# EAGLE schematic QED_2550_dos_caras (EAGLE 6.1)
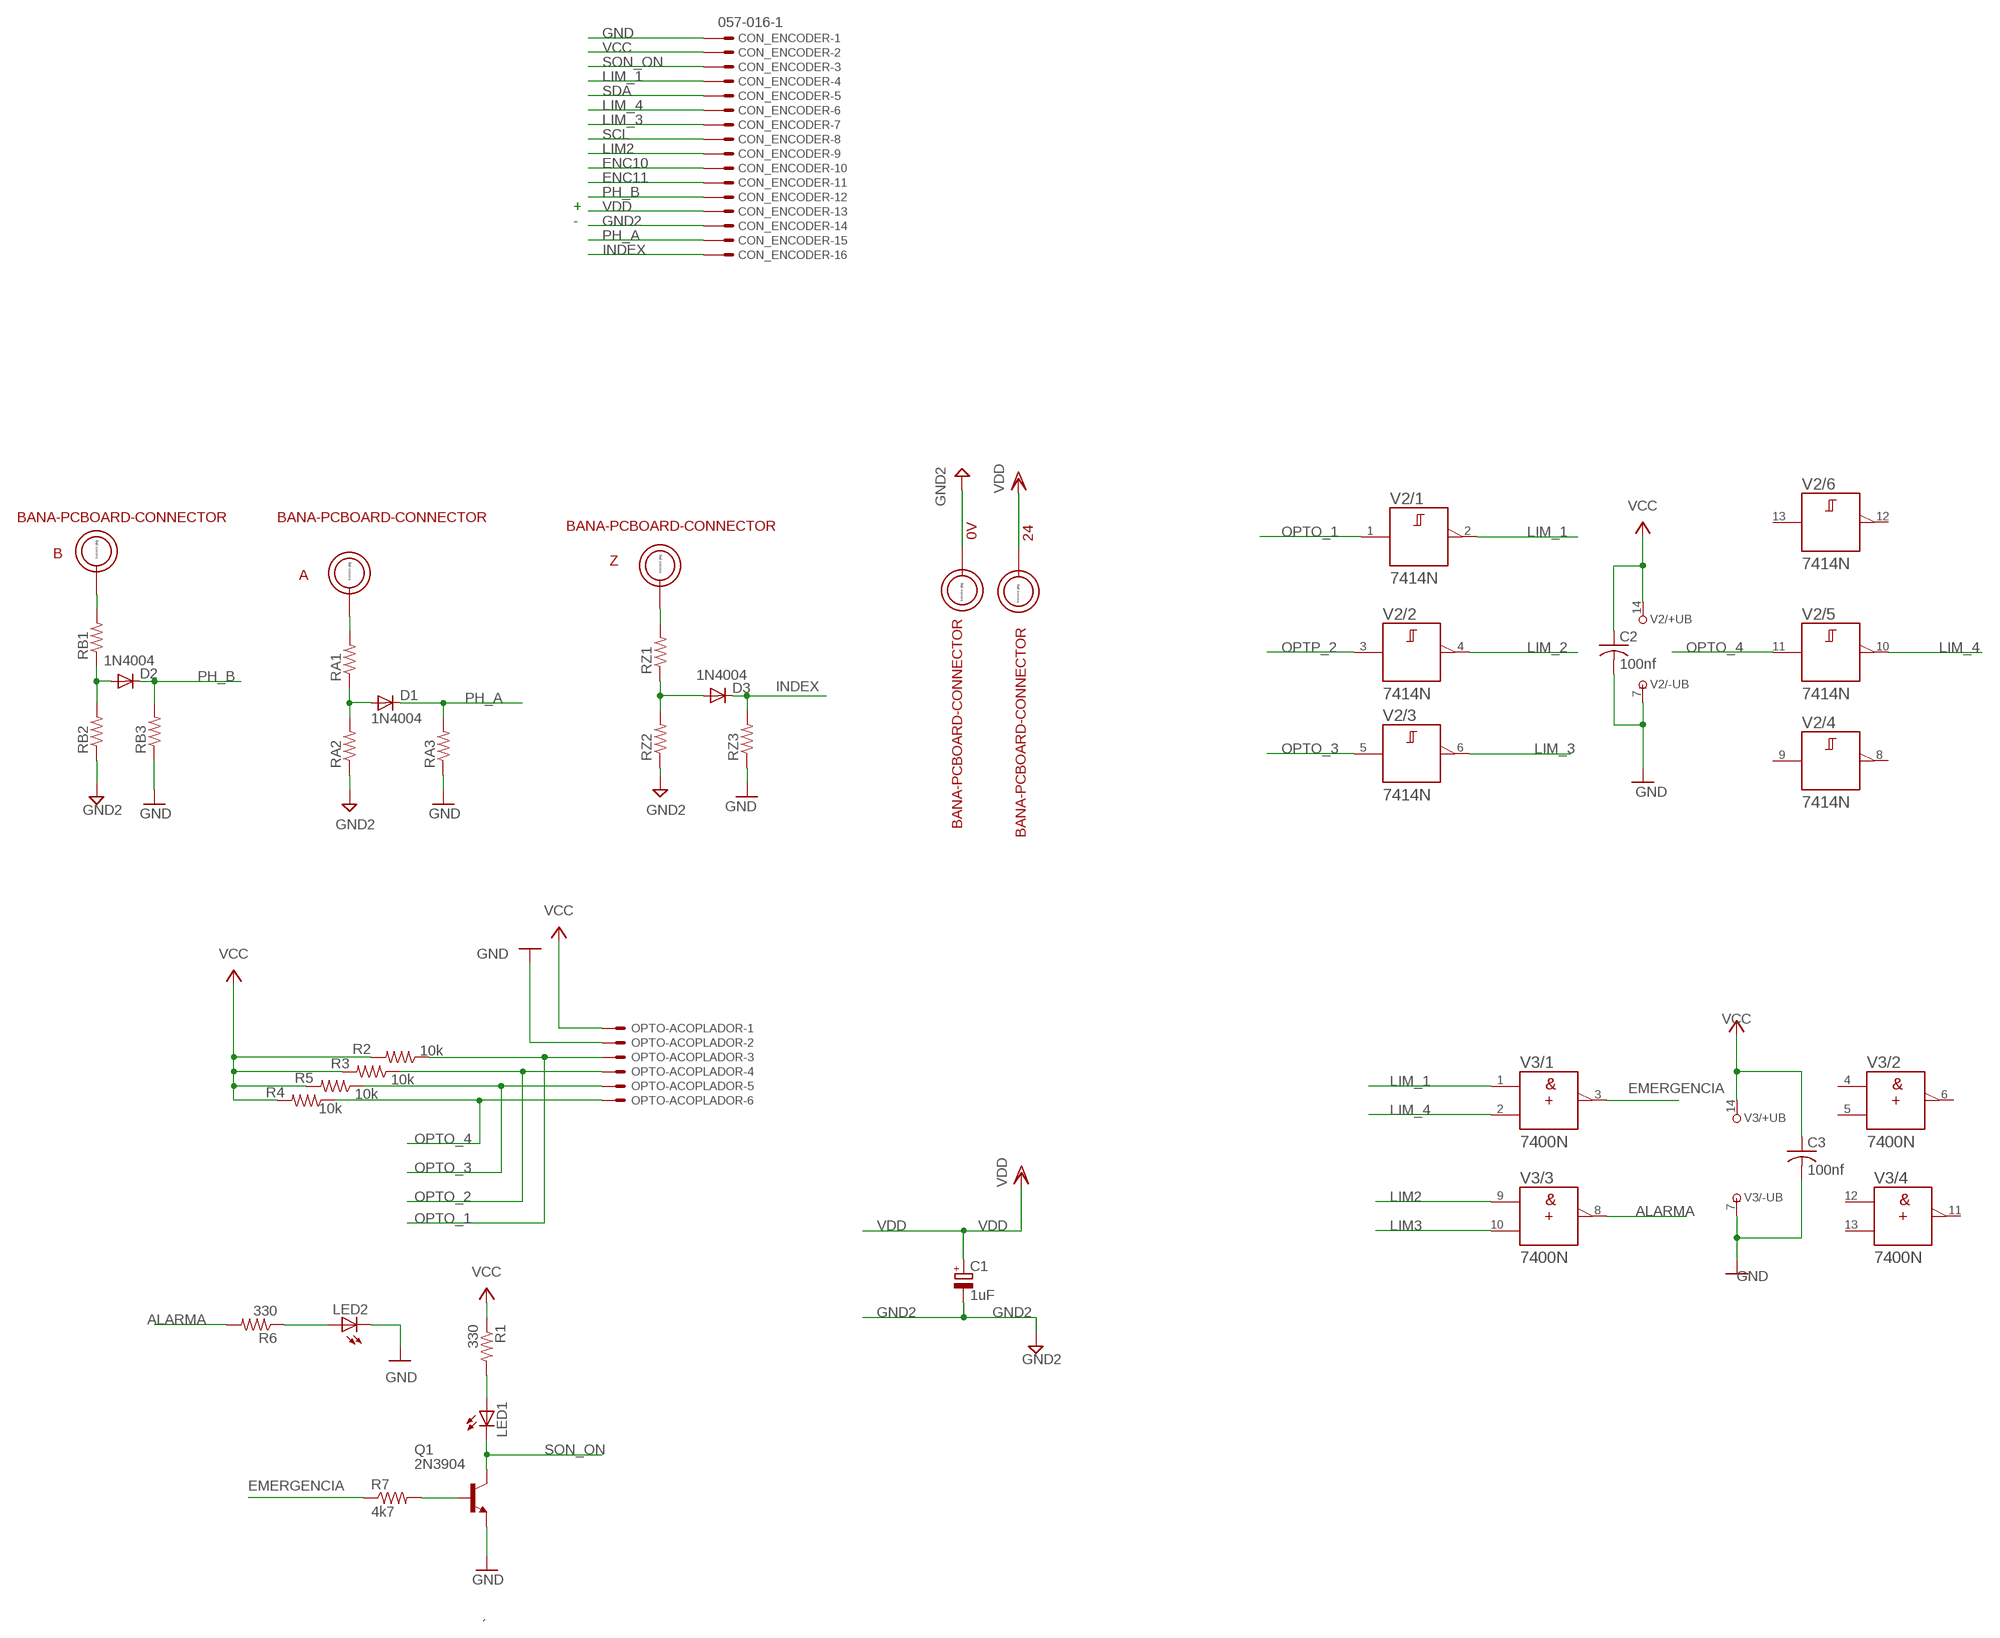
[diagram p0: schematic, sheet 1]

## Parts
0V  BANA-PCBOARD-CONNECTOR  [BANA_PLUG]
24  BANA-PCBOARD-CONNECTOR  [BANA_PLUG]
A  BANA-PCBOARD-CONNECTOR  [BANA_PLUG]
B  BANA-PCBOARD-CONNECTOR  [BANA_PLUG]
C1  1uF  CPOL-EUE2.5-6  [E2,5-6]
C2  100nf  C-US025-024X044  [C025-024X044]
C3  100nf  C-US025-024X044  [C025-024X044]
CON_ENCODER  057-016-1  [057-016-1]
D1  1N4004  [DO41-10]
D2  1N4004  [DO41-10]
D3  1N4004  [DO41-10]
LED1  LED5MM  [LED5MM]
LED2  LED5MM  [LED5MM]
OPTO-ACOPLADOR  22-23-2061  [22-23-2061]
Q1  2N3904  [TO92]
R1  330  R-US_0204/7  [0204/7]
R2  10k  R-US_0204/7  [0204/7]
R3  10k  R-US_0204/7  [0204/7]
R4  10k  R-US_0204/7  [0204/7]
R5  10k  R-US_0204/7  [0204/7]
R6  330  R-US_0204/7  [0204/7]
R7  4k7  R-US_0204/7  [0204/7]
RA1  R-US_0204/7  [0204/7]
RA2  R-US_0204/7  [0204/7]
RA3  R-US_0204/7  [0204/7]
RB1  R-US_0204/7  [0204/7]
RB2  R-US_0204/7  [0204/7]
RB3  R-US_0204/7  [0204/7]
RZ1  R-US_0204/7  [0204/7]
RZ2  R-US_0204/7  [0204/7]
RZ3  R-US_0204/7  [0204/7]
V2  7414N  [DIL14]
V3  7400N  [DIL14]
Z  BANA-PCBOARD-CONNECTOR  [BANA_PLUG]

## Nets
ALARMA: R6.2 V3.8(/3:Y)
EMERGENCIA: R7.1 V3.3(/1:Y)
ENC10: CON_ENCODER.10
ENC11: CON_ENCODER.11
GND [tierra_5v]: C2.2 C3.2 CON_ENCODER.1 LED2.K(C) OPTO-ACOPLADOR.2 Q1.3(E) RA3.1 RB3.1 RZ3.1 V2.7(/-UB:-UB) V3.7(/-UB:-UB)
GND2: 0V.P$1 C1.- CON_ENCODER.14 RA2.1 RB2.1 RZ2.1
INDEX: CON_ENCODER.16 D3.C RZ3.2
LIM2: CON_ENCODER.9 V3.9(/3:A)
LIM3: V3.10(/3:B)
LIM_1: CON_ENCODER.4 V2.2(/1:Y) V3.1(/1:A)
LIM_2: V2.4(/2:Y)
LIM_3: CON_ENCODER.7 V2.6(/3:Y)
LIM_4: CON_ENCODER.6 V2.10(/5:Y) V3.2(/1:B)
N$1: Q1.2(B) R7.2
N$3: LED1.A R1.2
N$6: LED2.A R6.1
N$8: D1.A RA1.1 RA2.2
N$10: D2.A RB1.1 RB2.2
N$12: RZ1.2 Z.P$1
N$16: B.P$1 RB1.2
N$17: A.P$1 RA1.2
N$19: D3.A RZ1.1 RZ2.2
OPTO_1: OPTO-ACOPLADOR.3 R2.1 V2.1(/1:A)
OPTO_2: OPTO-ACOPLADOR.4 R3.1
OPTO_3: OPTO-ACOPLADOR.5 R5.1 V2.5(/3:A)
OPTO_4: OPTO-ACOPLADOR.6 R4.1 V2.11(/5:A)
OPTP_2: V2.3(/2:A)
PH_A: CON_ENCODER.15 D1.C RA3.2
PH_B: CON_ENCODER.12 D2.C RB3.2
SCL: CON_ENCODER.8
SDA: CON_ENCODER.5
SON_ON: CON_ENCODER.3 LED1.K(C) Q1.1(C)
VCC [fuente_5v]: C2.1 C3.1 CON_ENCODER.2 OPTO-ACOPLADOR.1 R1.1 R2.2 R3.2 R4.2 R5.2 V2.14(/+UB:+UB) V3.14(/+UB:+UB)
VDD [fuente_24]: 24.P$1 C1.+ CON_ENCODER.13
Unconnected: V2.8(/4:Y) V2.9(/4:A) V2.12(/6:Y) V2.13(/6:A) V3.4(/2:A) V3.5(/2:B) V3.6(/2:Y) V3.11(/4:Y) V3.12(/4:A) V3.13(/4:B)

## Notes on the sheet
- +
- -

## Library data of the parts
0V 24 A B Z = banana-plug:BANA-PCBOARD-CONNECTOR: Banana Plug to PC Board connector
C1 = resistor:CPOL-EU: POLARIZED CAPACITOR, European symbol
C2 C3 = resistor:C-US: CAPACITOR, American symbol
CON_ENCODER = con-panduit:057-016-: CONNECTOR 10-pin series 057 contact pc board low profile headers; OC_FARNELL: unknown; OC_NEWARK: unknown
D1-D3 = diode:1N4004: DIODE general purpose rectifier, 1 A
LED1 LED2 = led:LED: LED OSRAM: - CHIPLED LG R971, LG N971, LY N971, LG Q971, LY Q971, LO R971, LY R971 LH N974, LH R974 LS Q976, LO Q976, LY Q976 LO Q996 - Hyper CHIPLED LW Q18S LB Q993, LB Q99A, LB R99A - SideLED LS A670, LO A670, LY A670, LG A670, LP A670 LB A673, LV A673, LT A673, LW A673 LH A674 LY A675 LS A676, LA A676, LO A676, LY A676, LW A676 LS A679, LY A679, LG A679 - Hyper Micro SIDELED® LS Y876, LA Y876, LO Y876, LY Y876 LT Y87S - SmartLED LW L88C, LW L88S LB L89C, LB L89S, LG L890 LS L89K, LO L89K, LY L89K LS L896, LA L896, LO L896, LY L896 - TOPLED LS T670, LO T670, LY T670, LG T670, LP T670 LSG T670, LSP T670, LSY T670, LOP T670, LYG T670 LG T671, LOG T671, LSG T671 LB T673, LV T673, LT T673, LW T673 LH T674 LS T676, LA T676, LO T676, LY T676, LB T676, LH T676, LSB T676, LW T676 LB T67C, LV T67C, LT T67C, LS T67K, LO T67K, LY T67K, LW E67C LS E67B, LA E67B, LO E67B, LY E67B, LB E67C, LV E67C, LT E67C LW T67C LS T679, LY T679, LG T679 LS T770, LO T770, LY T770, LG T770, LP T770 LB T773, LV T773, LT T773, LW T773 LH T774 LS E675, LA E675, LY E675, LS T675 LS T776, LA T776, LO T776, LY T776, LB T776 LHGB T686 LT T68C, LB T68C - Hyper Mini TOPLED® LB M676 - Mini TOPLED Santana® LG M470 LS M47K, LO M47K, LY M47K Source: http://www.osram.convergy.de LUXEON: - LUMILED® LXK2-PW12-R00, LXK2-PW12-S00, LXK2-PW14-U00, LXK2-PW14-V00 LXK2-PM12-R00, LXK2-PM12-S00, LXK2-PM14-U00 LXK2-PE12-Q00, LXK2-PE12-R00, LXK2-PE12-S00, LXK2-PE14-T00, LXK2-PE14-U00 LXK2-PB12-K00, LXK2-PB12-L00, LXK2-PB12-M00, LXK2-PB14-N00, LXK2-PB14-P00, LXK2-PB14-Q00 LXK2-PR12-L00, LXK2-PR12-M00, LXK2-PR14-Q00, LXK2-PR14-R00 LXK2-PD12-Q00, LXK2-PD12-R00, LXK2-PD12-S00 LXK2-PH12-R00, LXK2-PH12-S00 LXK2-PL12-P00, LXK2-PL12-Q00, LXK2-PL12-R00 Source: www.luxeon.com KINGBRIGHT: KA-3528ASYC Source: www.kingbright.com
OPTO-ACOPLADOR = con-molex:22-23-2061: .100" (2.54mm) Center Header - 6 Pin; MF: MOLEX; MPN: 22-23-2061; OC_FARNELL: 1462922; OC_NEWARK: 27C1933
Q1 = -redpic-diode-transistor:2N3904: NPN Transistor
R1-R7 RA1-RA3 RB1-RB3 RZ1-RZ3 = rcl:R-US_: RESISTOR, American symbol
V2 = 74ttl-din:74*14: Hex schmitt trigger INVERTER
V3 = 74ttl-din:74*00: Quad 2-input NAND gate

## Net classes
1 fuente_24: width 0.406 mm, clearance 0.305 mm
2 tierra_24: width 0.406 mm
3 fuente_5v: width 0.356 mm
4 tierra_5v: width 0.356 mm